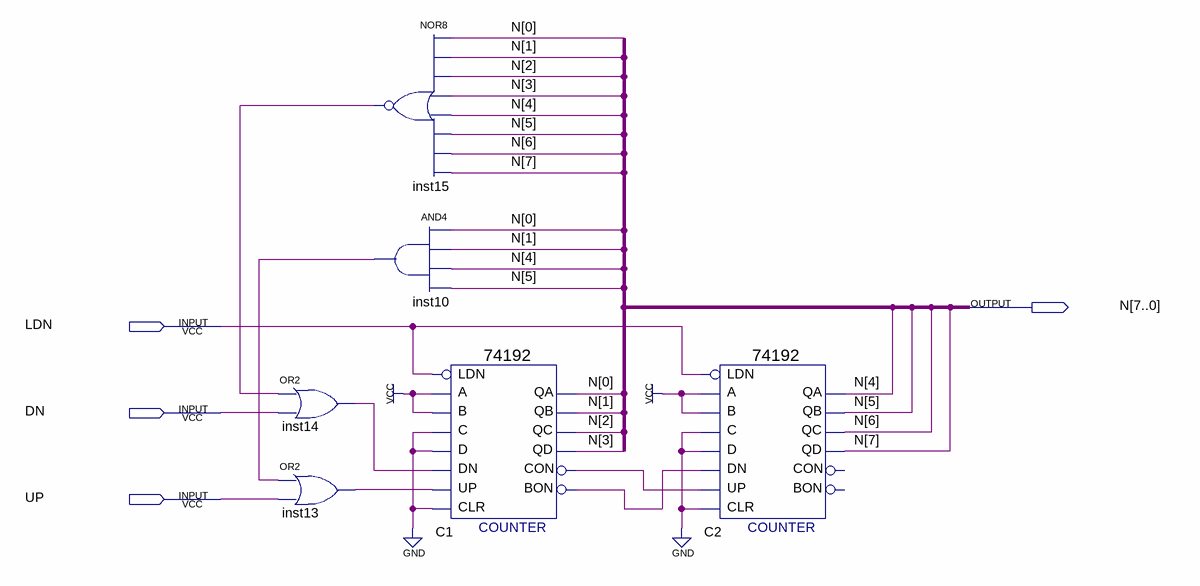
[diagram p0: schematic sheet]
// Quartus schematic contador_33.bdf as structural Verilog: 6 symbols, 4 pins
module contador_33 (
  input  LDN,
  input  DN,
  input  UP,
  output [7:0] N
);

  wire C1_bon, C1_con, inst10_out, inst13_out, inst14_out, inst15_out;

  or inst14 (inst14_out, inst15_out, DN);
  or inst13 (inst13_out, inst10_out, UP);
  nor inst15 (inst15_out, N[0], N[1], N[2], N[3], N[4], N[5], N[6], N[7]);
  and inst10 (inst10_out, N[0], N[1], N[4], N[5]);
  \74192  C1 (
    .D(1'b0), .C(1'b0), .A(1'b1), .B(1'b1), .CLR(1'b0), .UP(inst13_out), .DN(inst14_out), .LDN(LDN),
    .QB(N[1]), .BON(C1_bon), .CON(C1_con), .QA(N[0]), .QC(N[2]), .QD(N[3]));
  \74192  C2 (
    .D(1'b0), .C(1'b0), .A(1'b1), .B(1'b1), .CLR(1'b0), .UP(C1_con), .DN(C1_bon), .LDN(LDN), .QB(N[5]),
    .QA(N[4]), .QC(N[6]), .QD(N[7]));  // open: BON, CON
endmodule
